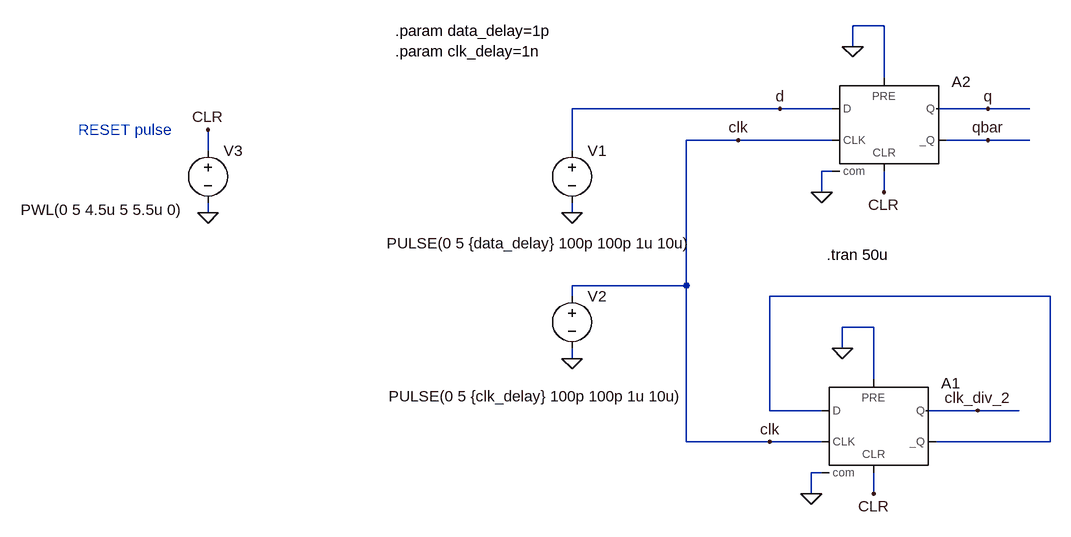
[diagram p0: schematic flipflop_basic_operation.asc]
flipflop_basic_operation.asc, the LTspice schematic file:
Version 4
SHEET 1 916 780
WIRE 272 -32 224 -32
WIRE 224 0 224 -32
WIRE 272 48 272 -32
WIRE 112 96 -208 96
WIRE 192 96 112 96
WIRE 432 96 352 96
WIRE 496 96 432 96
WIRE 48 144 -32 144
WIRE 192 144 48 144
WIRE 432 144 368 144
WIRE 496 144 432 144
WIRE -768 160 -768 128
WIRE -208 160 -208 96
WIRE 192 192 176 192
WIRE 176 224 176 192
WIRE 272 224 272 192
WIRE -768 256 -768 240
WIRE -208 256 -208 240
WIRE -32 368 -32 144
WIRE -32 368 -208 368
WIRE -208 384 -208 368
WIRE 528 384 96 384
WIRE 256 432 208 432
WIRE 208 464 208 432
WIRE -208 480 -208 464
WIRE 256 512 256 432
WIRE 96 560 96 384
WIRE 176 560 96 560
WIRE 416 560 336 560
WIRE 480 560 416 560
WIRE -32 608 -32 368
WIRE 96 608 -32 608
WIRE 176 608 96 608
WIRE 528 608 528 384
WIRE 528 608 352 608
WIRE 176 656 160 656
WIRE 160 688 160 656
WIRE 256 688 256 656
FLAG 176 224 0
FLAG -208 256 0
FLAG -208 480 0
FLAG 432 96 q
FLAG 432 144 qbar
FLAG 112 96 d
FLAG 48 144 clk
FLAG 224 0 0
FLAG 160 688 0
FLAG 416 560 clk_div_2
FLAG 208 464 0
FLAG 96 608 clk
FLAG 272 224 CLR
FLAG 256 688 CLR
FLAG -768 128 CLR
FLAG -768 256 0
SYMBOL voltage -208 144 R0
WINDOW 3 -285 159 Left 2
WINDOW 123 0 0 Left 2
WINDOW 39 0 0 Left 2
SYMATTR Value PULSE(0 5 {data_delay} 100p 100p 1u 10u)
SYMATTR InstName V1
SYMBOL voltage -208 368 R0
WINDOW 3 -282 170 Left 2
WINDOW 123 0 0 Left 2
WINDOW 39 0 0 Left 2
SYMATTR Value PULSE(0 5 {clk_delay} 100p 100p 1u 10u)
SYMATTR InstName V2
SYMBOL Digital\\dflop 256 512 R0
SYMATTR InstName A1
SYMATTR SpiceLine Vhigh=5 Tfall=5n Trise=5n Td=12n ref=2.5
SYMATTR SpiceLine2 rhigh=1 rlow=1
SYMBOL Digital\\dflop 272 48 R0
SYMATTR InstName A2
SYMATTR SpiceLine Vhigh=5 Tfall=5n Trise=5n Td=2n ref=2.5
SYMATTR SpiceLine2 rhigh=1 rlow=1
SYMBOL voltage -768 144 R0
WINDOW 3 -288 107 Left 2
WINDOW 123 0 0 Left 2
WINDOW 39 0 0 Left 2
SYMATTR Value PWL(0 5 4.5u 5 5.5u 0)
SYMATTR InstName V3
TEXT -480 -24 Left 2 !.param data_delay=1p\n.param clk_delay=1n
TEXT 184 320 Left 2 !.tran 50u
TEXT -968 128 Left 2 ;RESET pulse

The netlist it stands for:
* flipflop_basic_operation.asc
V1 d 0 PULSE(0 5 {data_delay} 100p 100p 1u 10u)
V2 clk 0 PULSE(0 5 {clk_delay} 100p 100p 1u 10u)
A1 N001 0 clk 0 CLR N001 clk_div_2 0 DFLOP Vhigh=5 Tfall=5n Trise=5n Td=12n ref=2.5 rhigh=1 rlow=1
A2 d 0 clk 0 CLR qbar q 0 DFLOP Vhigh=5 Tfall=5n Trise=5n Td=2n ref=2.5 rhigh=1 rlow=1
V3 CLR 0 PWL(0 5 4.5u 5 5.5u 0)
.param data_delay=1p
.param clk_delay=1n
.tran 50u
* RESET pulse
.backanno
.end